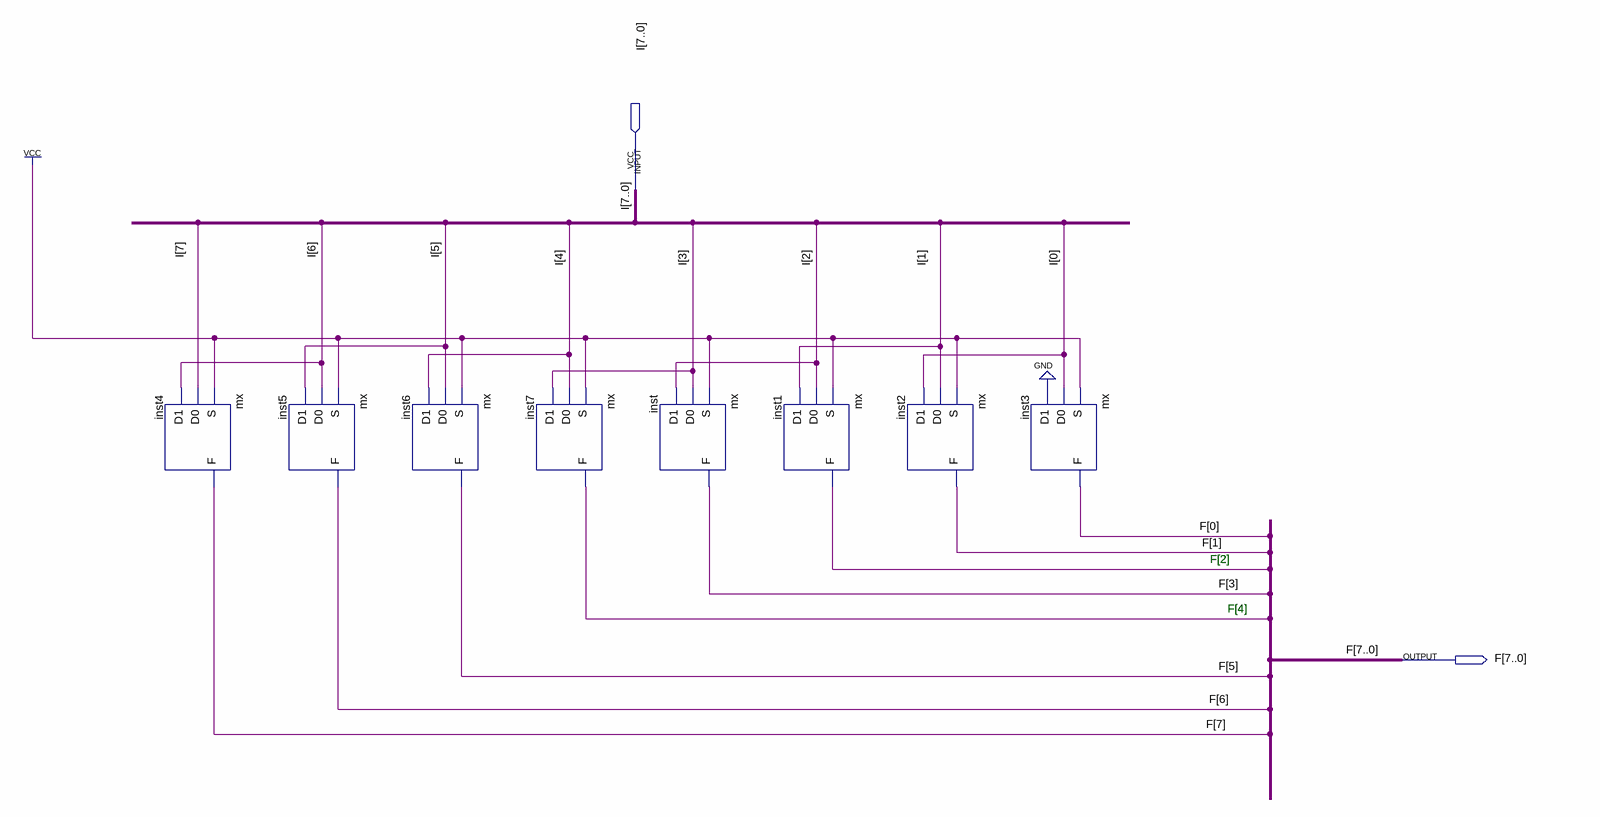
[diagram p0: schematic sheet]
// Quartus schematic ShiftL.bdf as structural Verilog: 8 symbols, 2 pins
module ShiftL (
  input  [7:0] I,
  output [7:0] F
);

  mx inst4 (.S(1'b1), .D0(I[7]), .D1(I[6]), .F(F[7]));
  mx inst5 (.S(1'b1), .D0(I[6]), .D1(I[5]), .F(F[6]));
  mx inst6 (.S(1'b1), .D0(I[5]), .D1(I[4]), .F(F[5]));
  mx inst7 (.S(1'b1), .D0(I[4]), .D1(I[3]), .F(F[4]));
  mx inst (.S(1'b1), .D0(I[3]), .D1(I[2]), .F(F[3]));
  mx inst1 (.S(1'b1), .D0(I[2]), .D1(I[1]), .F(F[2]));
  mx inst2 (.S(1'b1), .D0(I[1]), .D1(I[0]), .F(F[1]));
  mx inst3 (.S(1'b1), .D0(I[0]), .D1(1'b0), .F(F[0]));

  // Notes on the sheet:
  //   F[2]
  //   F[2]
  //   F[2]
  //   F[4]
endmodule
